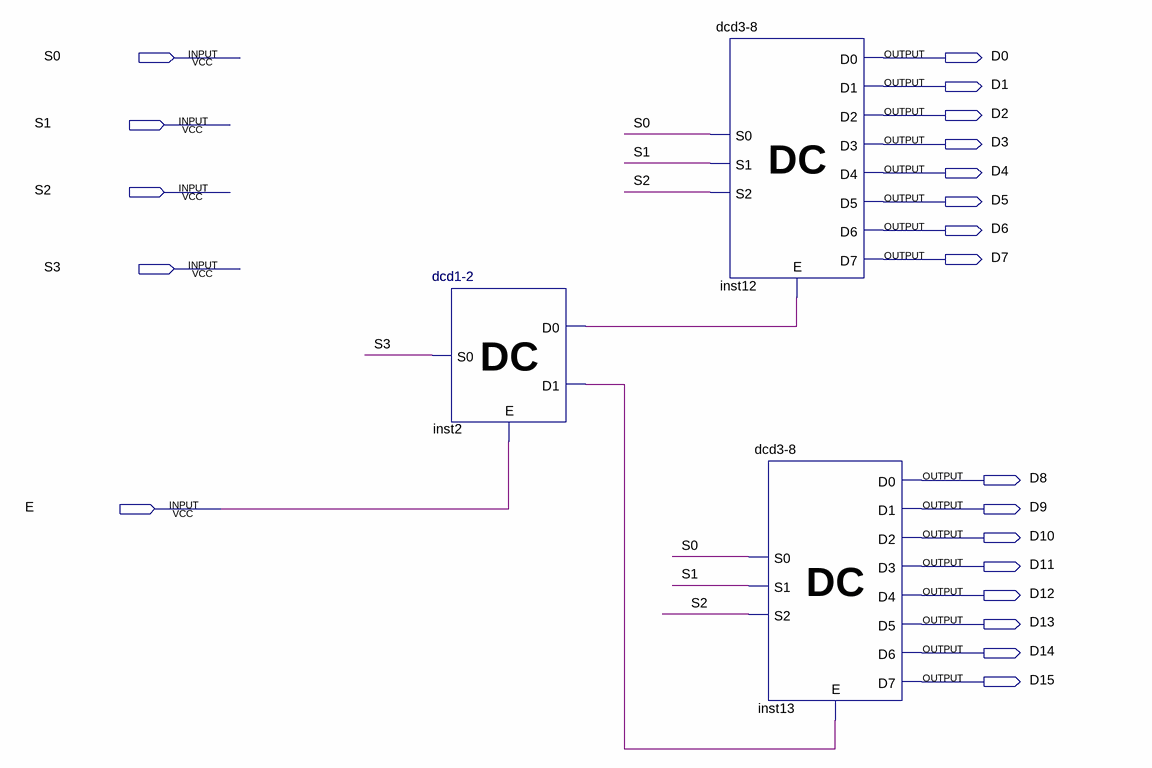
[diagram p0: schematic sheet]
// Quartus schematic dcd4-16.bdf as structural Verilog: 3 symbols, 21 pins
module \dcd4-16  (
  input  S0,
  input  S1,
  input  S2,
  input  S3,
  input  E,
  output D0,
  output D1,
  output D2,
  output D3,
  output D4,
  output D5,
  output D6,
  output D7,
  output D8,
  output D9,
  output D10,
  output D11,
  output D12,
  output D13,
  output D14,
  output D15
);

  wire inst2_d0, inst2_d1;

  \dcd1-2  inst2 (.E(E), .S0(S3), .D0(inst2_d0), .D1(inst2_d1));
  \dcd3-8  inst12 (
    .E(inst2_d0), .S0(S0), .S1(S1), .S2(S2), .D0(D0), .D1(D1), .D2(D2), .D3(D3), .D4(D4), .D5(D5), .D6(D6),
    .D7(D7));
  \dcd3-8  inst13 (
    .E(inst2_d1), .S0(S0), .S1(S1), .S2(S2), .D0(D8), .D1(D9), .D2(D10), .D3(D11), .D4(D12), .D5(D13),
    .D6(D14), .D7(D15));
endmodule
